# Altium schematic sheet p1_bt_sorry.SchDoc (part 1 of 3)
size OrCAD B; CompanyName: MSX Consulting, LLC; DocumentNumber: 1; SheetNumber: 1; SheetTotal: 1
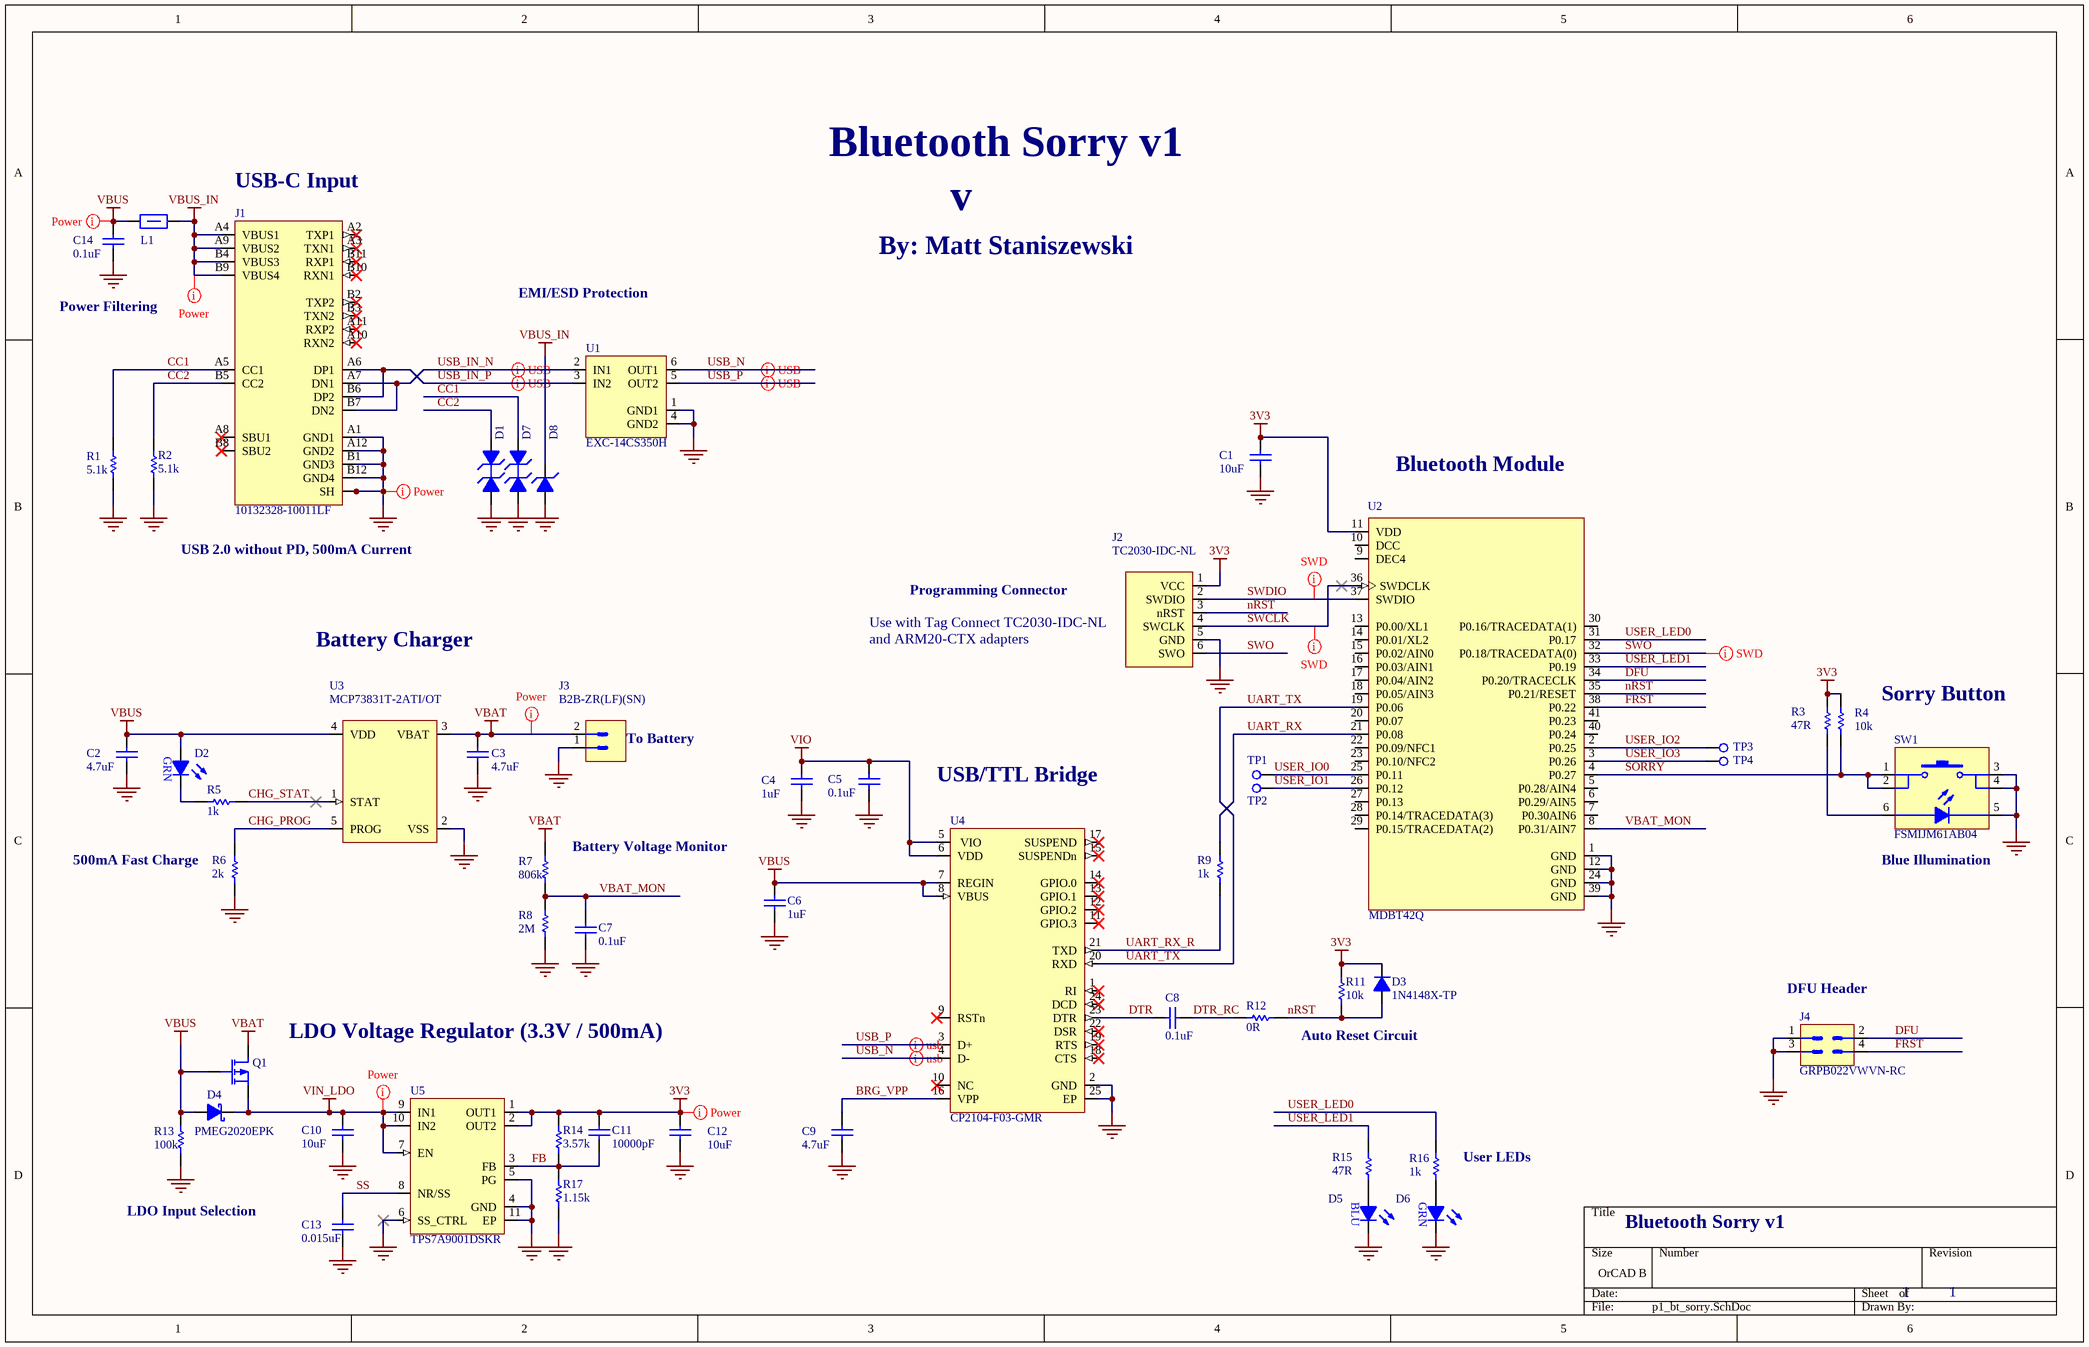
[diagram p0: p1_bt_sorry.SchDoc]

## Parts
C1  10uF  [C0402]
C2  4.7uF  [C0402]
C3  4.7uF  [C0402]
C4  1uF  [C0402]
C5  0.1uF  [C0201]
C6  1uF  [C0402]
C7  0.1uF  [C0201]
C8  0.1uF  [C0201]
C9  4.7uF  [C0402]
C10  10uF  [C0402]
C11  10000pF  [C0402]
C12  10uF  [C0402]
C13  0.015uF  [C0402]
C14  0.1uF  [C0201]
D1  ESDAXLC6-1BU2  [ONS_0201]  (value not drawn)
D2  5988070107F  [LED0603]  (value not drawn)
D3  1N4148X-TP  [MCC_SOD523]
D4  PMEG2020EPK  [NXP_DFN1608D-2]
D5  5988091107F  [LED0603]  (value not drawn)
D6  5988070107F  [LED0603]  (value not drawn)
D7  ESDAXLC6-1BU2  [ONS_0201]  (value not drawn)
D8  ESDA7P60-1U1M  [STM_1610]  (value not drawn)
J1  10132328-10011LF  [AMP_USBC_VT]
J2  TC2030-IDC-NL  [TAG_6P]
J3  B2B-ZR(LF)(SN)  [JST_ZH_2P_PTH_VT]
J4  GRPB022VWVN-RC  [HDR10_2X2_0.05IN]
L1  BLM15PX601SN1D  [L0402]  (value not drawn)
Q1  DMP21D0UFB4-7B  [DIO_X2-DFN1006-3]  (value not drawn)
R1  5.1k  [R0402]
R2  5.1k  [R0402]
R3  47R  [R0402]
R4  10k  [R0402]
R5  1k  [R0402]
R6  2k  [R0402]
R7  806k  [R0402]
R8  2M  [R0402]
R9  1k  [R0402]
R11  10k  [R0402]
R12  0R  [R0402]
R13  100k  [R0402]
R14  3.57k  [R0402]
R15  47R  [R0402]
R16  1k  [R0402]
R17  1.15k  [R0402]
SW1  FSMIJM61AB04  [TE_FSMIJM61AB04]
TP1  TP SMT 0.5MM  [TP_SMT_0.5MM]  (value not drawn)  (no BOM)
TP2  TP SMT 0.5MM  [TP_SMT_0.5MM]  (value not drawn)  (no BOM)
TP3  TP SMT 0.5MM  [TP_SMT_0.5MM]  (value not drawn)  (no BOM)
TP4  TP SMT 0.5MM  [TP_SMT_0.5MM]  (value not drawn)  (no BOM)
U1  EXC-14CS350H  [PAN_EXC14CS]
U2  MDBT42Q  [RAY_MDBT42Q]
U3  MCP73831T-2ATI/OT  [MCP_SOT23-5]
U4  CP2104-F03-GMR  [SIL_QFN-24]
U5  TPS7A9001DSKR  [TI_DSK]

## Nets
3V3: C1.2 C11.2 C12.2 D3.1(K) J2.1(VCC) R3.2 R4.2 R11.2 R14.2 U2.11(VDD) U5.1(OUT1) U5.2(OUT2)
GND: C1.1 C2.1 C3.1 C4.1 C5.1 C6.1 C7.1 C9.1 C10.1 C12.1 C13.1 C14.1 D1.1(A1) D5.1(K) D6.1(K) D7.1(A1) D8.2(A) J1.A1(GND1) J1.A12(GND2) J1.B1(GND3) J1.B12(GND4) J1.SHA1(SH) J1.SHA2(SH) J1.SHA3(SH) J1.SHA4(SH) J1.SHA5(SH) J1.SHA6(SH) J1.SHA7(SH) J1.SHB1(SH) J1.SHB2(SH) J1.SHB3(SH) J1.SHB4(SH) J1.SHB5(SH) J1.SHB6(SH) J1.SHB7(SH) J2.5(GND) J3.1 J4.1 J4.3 R1.1 R2.1 R6.1 R8.1 R13.1 R17.1 SW1.3 SW1.4 SW1.5 U1.1(GND1) U1.4(GND2) U2.1(GND) U2.12(GND) U2.24(GND) U2.39(GND) U3.2(VSS) U4.2(GND) U4.25(EP) U5.4(GND) U5.5(PG) U5.6(SS_CTRL) U5.11(EP)
VBAT: C3.2 J3.2 Q1.3(D) R7.2 U3.3(VBAT)
VBUS: C2.2 C6.2 C14.2 D2.2(A) D4.2(A) L1.2 Q1.1(G) R13.2 U3.4(VDD) U4.7(REGIN) U4.8(VBUS)
VBUS_IN: D8.1(K) J1.A4(VBUS1) J1.A9(VBUS2) J1.B4(VBUS3) J1.B9(VBUS4) L1.1
VIN_LDO: C10.2 D4.1(K) Q1.2(S) U5.7(EN) U5.9(IN1) U5.10(IN2)
VIO: C4.2 C5.2 U4.5(VIO) U4.6(VDD)
BRG_VPP: C9.2 U4.16(VPP)
CC1: D7.2(A2) J1.A5(CC1) R1.2
CC2: D1.2(A2) J1.B5(CC2) R2.2
CHG_PROG: R6.2 U3.5(PROG)
CHG_STAT: R5.2 U3.1(STAT)
DFU: J4.2 U2.34(P0.20/TRACECLK)
DTR: C8.2 U4.23(DTR)
DTR_RC: C8.1 R12.1
FB: C11.1 R14.1 R17.2 U5.3(FB)
FRST: J4.4 U2.38(P0.22)
nRST: D3.2(A) J2.3(nRST) R11.1 R12.2 U2.35(P0.21/RESET)
SORRY: R4.1 SW1.1 SW1.2 U2.4(P0.27)
SS: C13.2 U5.8(NR/SS)
SWCLK: J2.4(SWCLK) U2.36(SWDCLK)
SWDIO: J2.2(SWDIO) U2.37(SWDIO)
SWO: J2.6(SWO) U2.32(P0.18/TRACEDATA(0))
UART_RX: R9.1 U2.21(P0.08)
UART_RX_R: R9.2 U4.21(TXD)
UART_TX: U2.19(P0.06) U4.20(RXD)
USB_IN_N: J1.A7(DN1) J1.B7(DN2) U1.2(IN1)
USB_IN_P: J1.A6(DP1) J1.B6(DP2) U1.3(IN2)
USB_N: U1.6(OUT1) U4.4(D-)
USB_P: U1.5(OUT2) U4.3(D+)
USER_IO0: TP1.1 U2.25(P0.11)
USER_IO1: TP2.1 U2.26(P0.12)
USER_IO2: TP3.1 U2.2(P0.25)
USER_IO3: TP4.1 U2.3(P0.26)
USER_LED0: R16.2 U2.31(P0.17)
USER_LED1: R15.2 U2.33(P0.19)
VBAT_MON: C7.2 R7.1 R8.2 U2.8(P0.31/AIN7)
NetD2_1: D2.1(K) R5.1
NetD5_2: D5.2(A) R15.1
NetD6_2: D6.2(A) R16.1
NetR3_1: R3.1 SW1.6

Not connected (* = marked no-connect by the designer): J1 A2(TXP1)* A3(TXN1)* A8(SBU1)* A10(RXN2)* A11(RXP2)* B2(TXP2)* B3(TXN2)* B8(SBU2)* B10(RXN1)* B11(RXP1)*; U2 5(P0.28/AIN4) 6(P0.29/AIN5) 7(P0.30AIN6) 9(DEC4) 10(DCC) 13(P0.00/XL1) 14(P0.01/XL2) 15(P0.02/AIN0) 16(P0.03/AIN1) 17(P0.04/AIN2) 18(P0.05/AIN3) 20(P0.07) 22(P0.09/NFC1) 23(P0.10/NFC2) 27(P0.13) 28(P0.14/TRACEDATA(3)) 29(P0.15/TRACEDATA(2)) 30(P0.16/TRACEDATA(1)) 40(P0.24) 41(P0.23); U4 1(RI)* 9(RSTn)* 10(NC)* 11(GPIO.3)* 12(GPIO.2)* 13(GPIO.1)* 14(GPIO.0)* 15(SUSPENDn)* 17(SUSPEND)* 18(CTS)* 19(RTS)* 22(DSR)* 24(DCD)*

## Layout directives
differential pair: USB_N, USB_P
differential pair; differential pair class USB; net class USB: USB_IN_N, USB_IN_P, USB_N, USB_P
net class SWD: SWCLK, SWDIO, SWO
net class Power: 3V3, GND, VBAT, VBUS, VBUS_IN, VIN_LDO

## Notes on the sheet
- (near J1) USB-C Input
- Bluetooth Sorry v1
- v
- By: Matt Staniszewski
- Power Filtering
- EMI/ESD Protection
- Bluetooth Module
- USB 2.0 without PD, 500mA Current
- Programming Connector
- Battery Charger
- Use with Tag Connect TC2030-IDC-NL and ARM20-CTX adapters
- (near J3) To Battery
- Sorry Button
- USB/TTL Bridge
- 500mA Fast Charge
- (near R7) Battery Voltage Monitor
- (near SW1) Blue Illumination
- (near J4) DFU Header
- LDO Voltage Regulator (3.3V / 500mA)
- Auto Reset Circuit
- (near R16) User LEDs
- LDO Input Selection
- (in symbol Blue 0603 LED) BLU
- (in symbol Green 0603 LED) GRN